# Altium schematic sheet Breakout.SchDoc
size A
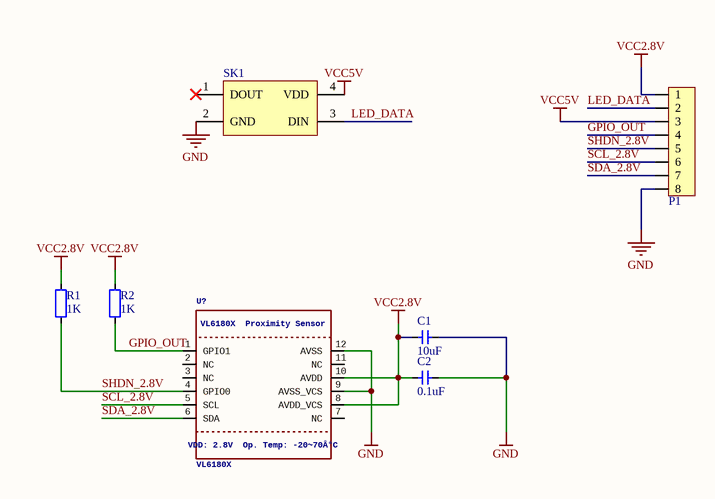
[diagram p0: Breakout.SchDoc]

## Parts
C1  value 10uF  [CAP_0805]  (hidden comment: Cap_0805)
C2  value 0.1uF  [CAP_0603]  (hidden comment: Cap_0603)
P1  HDR1x8_1.27  [HDR1X8_1.27_180]  (value not drawn)
R1  value 1K  [RES_0603]  (hidden comment: Res_0603)
R2  value 1K  [RES_0603]  (hidden comment: Res_0603)
SK1  LED_3535_SK6812  [LED_3535_4P]  (value not drawn)
U?  VL6180X  VL6180X
ProximitySensor: VL6180X / Proximity Sensor  VDD:2.8V
Op.Temp:-20~70Â°C: VDD: 2.8V / Op. Temp: -20~70Â°C  [LGA12_ST_4.8X2.8X1MM]

## Nets
GND: C1.1 C2.1 P1.8 SK1.2(GND) U?.9(AVSS_VCS) U?.12(AVSS)
VCC2.8V: C1.2 C2.2 P1.1 R1.2 R2.2 U?.8(AVDD_VCS) U?.10(AVDD)
VCC5V: P1.3 SK1.4(VDD)
GPIO_OUT: P1.4 R2.1 U?.1(GPIO1)
LED_DATA: P1.2 SK1.3(DIN)
SCL_2.8V: P1.6 U?.5(SCL)
SDA_2.8V: P1.7 U?.6(SDA)
SHDN_2.8V: P1.5 R1.1 U?.4(GPIO0)

Not connected (* = marked no-connect by the designer): SK1 1(DOUT)*; U? 2(NC) 3(NC) 7(NC) 11(NC)

## Library data of the parts
C1 = Cap_0805: Capacitor
C2 = Cap_0603: Capacitor
P1 = HDR1x8_1.27: Header
R1 R2 = Res_0603: Resistor
SK1 = LED_3535_SK6812: LED
U? = VL6180X: VL6180x Proximity and Light Sensor with Gesture Recognition    Supply Level: 2.8V (3.0V Max!)  Range: 0-10cm  Light Sensor: 0..100K Lux (16-bit output)  IR emitter: 850 nm  I2C Address: 0x29 (7-bit)